# Altium schematic sheet MC33886_PowerModule.SchDoc
size A4
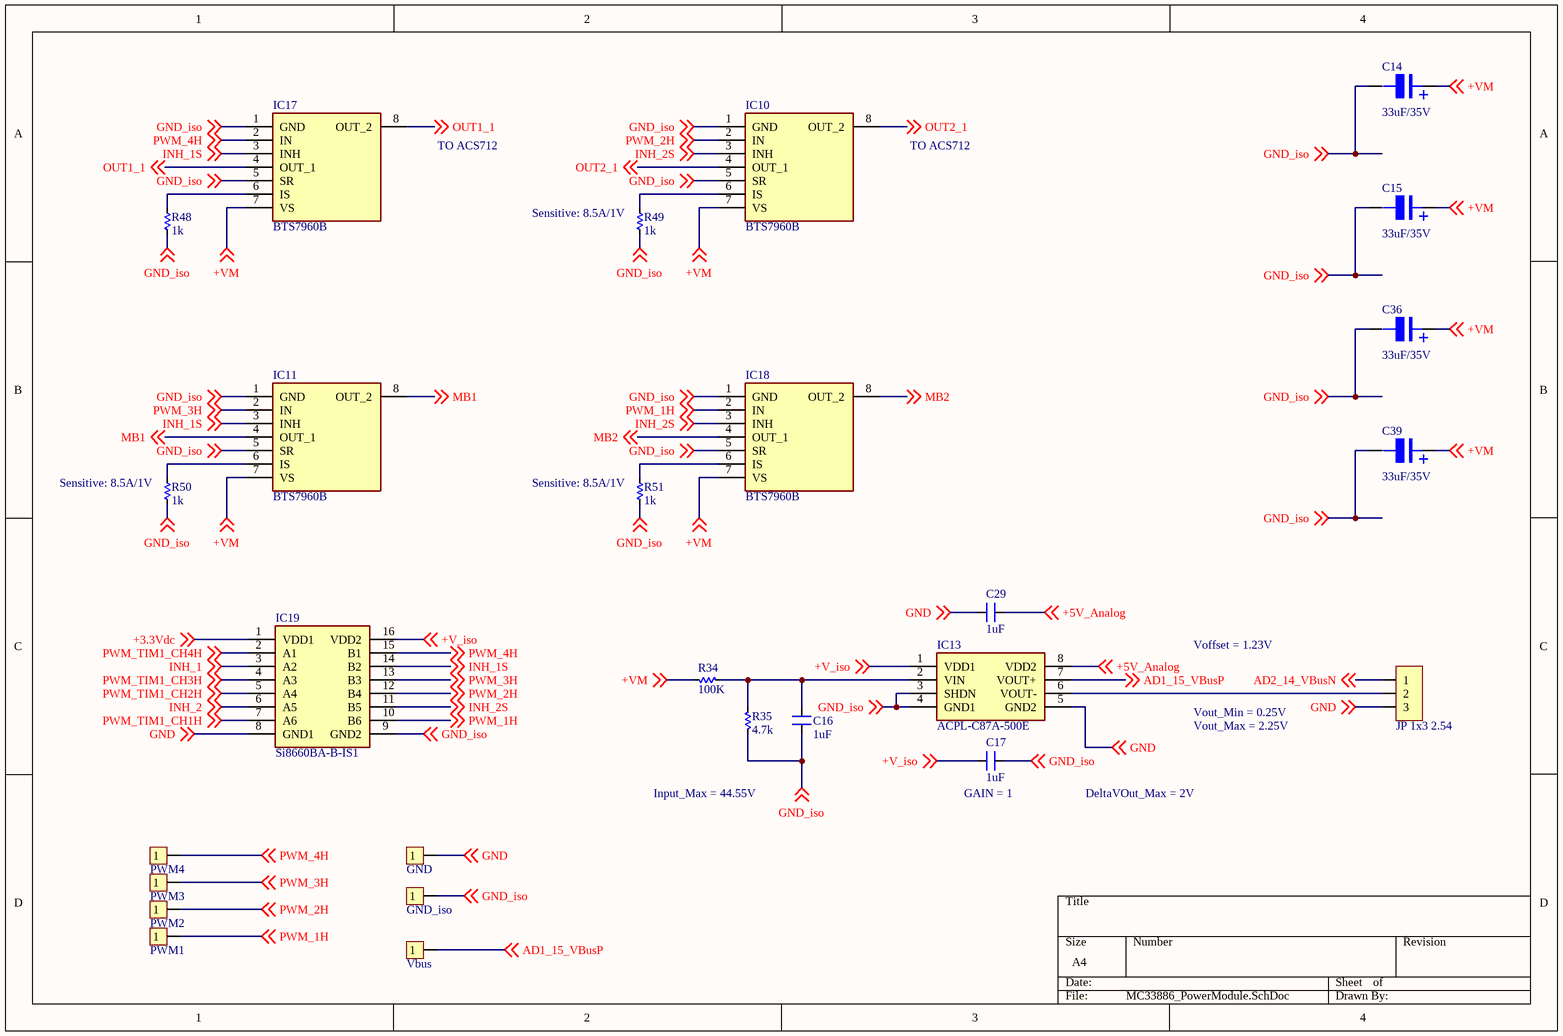
[diagram p0: MC33886_PowerModule.SchDoc]

## Parts
C14  33uF/35V  [tu nhom 8 (e)]
C15  33uF/35V  [tu nhom 8 (e)]
C16  1uF  [CM-0805 capacitor]
C17  1uF  [CM-0805 capacitor]
C29  1uF  [CM-0805 capacitor]
C36  33uF/35V  [tu nhom 8 (e)]
C39  33uF/35V  [tu nhom 8 (e)]
GND  GND  [JP 1x1 DT]
GND_iso  GND_iso  [JP 1x1 DT]
IC10  BTS7960B  [BTS7960B]
IC11  BTS7960B  [BTS7960B]
IC13  ACPL-C87A-500E  [SOIC127P1150X361-8N]
IC17  BTS7960B  [BTS7960B]
IC18  BTS7960B  [BTS7960B]
IC19  Si8660BA-B-IS1  [SOIC127P600X175-16N]
JP3  JP 1x3 2.54  [JP 1x3 DT]
PWM1  PWM1  [JP 1x1 DT]
PWM2  PWM2  [JP 1x1 DT]
PWM3  PWM3  [JP 1x1 DT]
PWM4  PWM4  [JP 1x1 DT]
R34  100K  [RES-SMD-0805]
R35  4.7k  [RES-SMD-0805]
R48  1k  [RES-SMD-0805]
R49  1k  [RES-SMD-0805]
R50  1k  [RES-SMD-0805]
R51  1k  [RES-SMD-0805]
Vbus  Vbus  [JP 1x1 DT]

## Nets
+3.3Vdc: IC19.1(VDD1) ; off-sheet +3.3Vdc
+5V_Analog: C29.1 IC13.8(VDD2) ; off-sheet +5V_Analog
+V_iso: C17.1 IC13.1(VDD1) IC19.16(VDD2) ; off-sheet +V_iso
+VM: C14.1 C15.1 C36.1 C39.1 IC10.7(VS) IC11.7(VS) IC17.7(VS) IC18.7(VS) R34.1 ; off-sheet +VM
AD1_15_VBusP: IC13.7(VOUT+) Vbus.1 ; off-sheet AD1_15_VBusP
AD2_14_VBusN: JP3.1 ; off-sheet AD2_14_VBusN
GND: C29.2 GND.1 IC13.5(GND2) IC19.8(GND1) JP3.3 ; off-sheet GND
GND_iso: C14.2 C15.2 C16.2 C17.2 C36.2 C39.2 GND_iso.1 IC10.1(GND) IC10.5(SR) IC11.1(GND) IC11.5(SR) IC13.3(SHDN) IC13.4(GND1) IC17.1(GND) IC17.5(SR) IC18.1(GND) IC18.5(SR) IC19.9(GND2) R35.2 R48.2 R49.2 R50.2 R51.2 ; off-sheet GND_iso
INH_1: IC19.3(A2) ; off-sheet INH_1
INH_1S: IC11.3(INH) IC17.3(INH) IC19.14(B2) ; off-sheet INH_1S
INH_2: IC19.6(A5) ; off-sheet INH_2
INH_2S: IC10.3(INH) IC18.3(INH) IC19.11(B5) ; off-sheet INH_2S
MB1: IC11.4(OUT_1) IC11.8(OUT_2) ; off-sheet MB1
MB2: IC18.4(OUT_1) IC18.8(OUT_2) ; off-sheet MB2
OUT1_1: IC17.4(OUT_1) IC17.8(OUT_2) ; off-sheet OUT1_1
OUT2_1: IC10.4(OUT_1) IC10.8(OUT_2) ; off-sheet OUT2_1
PWM_1H: IC18.2(IN) IC19.10(B6) PWM1.1 ; off-sheet PWM_1H
PWM_2H: IC10.2(IN) IC19.12(B4) PWM2.1 ; off-sheet PWM_2H
PWM_3H: IC11.2(IN) IC19.13(B3) PWM3.1 ; off-sheet PWM_3H
PWM_4H: IC17.2(IN) IC19.15(B1) PWM4.1 ; off-sheet PWM_4H
PWM_TIM1_CH1H: IC19.7(A6) ; off-sheet PWM_TIM1_CH1H
PWM_TIM1_CH2H: IC19.5(A4) ; off-sheet PWM_TIM1_CH2H
PWM_TIM1_CH3H: IC19.4(A3) ; off-sheet PWM_TIM1_CH3H
PWM_TIM1_CH4H: IC19.2(A1) ; off-sheet PWM_TIM1_CH4H
NetC16_1: C16.1 IC13.2(VIN) R34.2 R35.1
NetIC10_6: IC10.6(IS) R49.1
NetIC11_6: IC11.6(IS) R50.1
NetIC13_6: IC13.6(VOUT-) JP3.2
NetIC17_6: IC17.6(IS) R48.1
NetIC18_6: IC18.6(IS) R51.1

## Notes on the sheet
- TO ACS712
- (near R49) Sensitive: 8.5A/1V
- (near R50) Sensitive: 8.5A/1V
- (near R51) Sensitive: 8.5A/1V
- Voffset = 1.23V
- Vout_Min = 0.25V
- Vout_Max = 2.25V
- Input_Max = 44.55V
- (near C17) GAIN = 1
- DeltaVOut_Max = 2V
- (in symbol Tu Nhom 33uF 35V) +

## Library data of the parts
C14 C15 C36 C39 = Tu Nhom 33uF 35V: Dán; Don_Vi: Con; So_Chan: 2; Ten_Linh_Kien: Tụ Nhôm 33uF 35V; Ma_Hang: MH004017; Chung_Loai: Dán; Kieu_Chan: *
C16 C17 C29 = CN: 0805_SMD_20pF; Value: 100pF
GND GND_iso PWM1-PWM4 Vbus = JP 1x1 2.54 Duc Cong: Cắm; Ten_Linh_Kien: Jump Đơn Đực 2.54MM 1x40P Cong Đứng; Don_Vi: Con; Ma_Hang: MH000904; Ghi_Chu: *; Kieu_Chan: *; Chung_Loai: Cắm
IC10 IC11 IC17 IC18 = BTS7960B: Integrated Circuit; Manufacturer_Name: Rochester Electronics; Height: 4.4mm; Manufacturer_Part_Number: BTS7960B
IC13 = ACPL-C87A-500E: Integrated Circuit; Manufacturer_Name: Avago Technologies; Datasheet Link: https://docs.broadcom.com/docs/AV02-3563EN; Height: 3.607mm; Manufacturer_Part_Number: ACPL-C87A-500E; Mouser Part Number: 630-ACPL-C87A-500E; Mouser Price/Stock: https://www.mouser.co.uk/ProductDetail/Broadcom-Avago/ACPL-C87A-500E?qs=mhB89zxvawnihD62lh78rg%3D%3D
IC19 = Si8660BA-B-IS1: Integrated Circuit; Manufacturer_Name: Silicon Labs; Datasheet Link: https://www.silabs.com/documents/public/data-sheets/Si866x.pdf; Height: 1.75mm; Manufacturer_Part_Number: Si8660BA-B-IS1; Mouser Part Number: 634-SI8660BA-B-IS1; Mouser Price/Stock: https://www.mouser.co.uk/ProductDetail/Silicon-Labs/SI8660BA-B-IS1?qs=j6MGy4L9yX2XGnehVpuudQ%3D%3D; Arrow Part Number: Si8660BA-B-IS1; Arrow Price/Stock: https://www.arrow.com/en/products/si8660ba-b-is1/silicon-labs
JP3 = JP 1x3 2.54 Duc Thang: Cắm; Ten_Linh_Kien: Jump Đơn Đực 2.54MM 1x40P Thẳng 11MM; Don_Vi: Con; Ma_Hang: MH000903; Ghi_Chu: *; Kieu_Chan: *; Chung_Loai: Cắm
R34 R35 R48-R51 = Res-SMD: Resistor; Manufacturer: Generic Components; Class: Passive; Published: 08/06/2000; Publisher: Altium Hobart Technology Centre